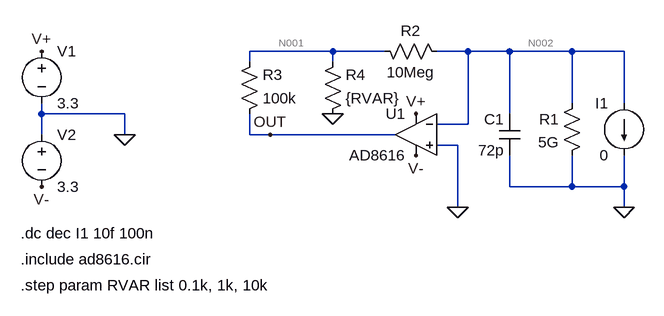
[diagram p0: schematic 002transimpedance_ad8616_three_res.asc]
002transimpedance_ad8616_three_res.asc, the LTspice schematic file:
Version 4
SHEET 1 1156 680
WIRE 112 48 -16 48
WIRE 192 48 112 48
WIRE 320 48 272 48
WIRE 384 48 320 48
WIRE 480 48 384 48
WIRE 560 48 480 48
WIRE -16 64 -16 48
WIRE 112 64 112 48
WIRE 480 128 480 48
WIRE 560 128 560 48
WIRE -336 144 -336 128
WIRE -208 144 -336 144
WIRE 384 144 384 48
WIRE 320 160 320 48
WIRE 320 160 272 160
WIRE -336 176 -336 144
WIRE -208 176 -208 144
WIRE -16 176 -16 144
WIRE 16 176 -16 176
WIRE 208 176 16 176
WIRE 304 192 272 192
WIRE 384 256 384 208
WIRE 480 256 480 208
WIRE 480 256 384 256
WIRE 560 256 560 208
WIRE 560 256 480 256
WIRE 304 288 304 192
WIRE 560 288 560 256
FLAG 560 288 0
FLAG 304 288 0
FLAG -208 176 0
FLAG -336 48 V+
FLAG -336 256 V-
FLAG 240 208 V-
FLAG 240 144 V+
FLAG 16 176 OUT
FLAG 112 144 0
SYMBOL current 560 128 M0
WINDOW 123 0 0 Left 2
WINDOW 39 0 0 Left 2
SYMATTR InstName I1
SYMATTR Value 0
SYMBOL res 496 112 M0
SYMATTR InstName R1
SYMATTR Value 5G
SYMBOL cap 400 144 M0
SYMATTR InstName C1
SYMATTR Value 72p
SYMBOL res 176 32 M90
WINDOW 0 0 56 VBottom 2
WINDOW 3 32 56 VTop 2
SYMATTR InstName R2
SYMATTR Value 10Meg
SYMBOL voltage -336 32 R0
WINDOW 123 0 0 Left 2
WINDOW 39 0 0 Left 2
SYMATTR InstName V1
SYMATTR Value 3.3
SYMBOL voltage -336 160 R0
WINDOW 123 0 0 Left 2
WINDOW 39 0 0 Left 2
SYMATTR InstName V2
SYMATTR Value 3.3
SYMBOL res -32 160 M180
WINDOW 0 36 76 Left 2
WINDOW 3 36 40 Left 2
SYMATTR InstName R3
SYMATTR Value 100k
SYMBOL res 96 160 M180
WINDOW 0 36 76 Left 2
WINDOW 3 36 40 Left 2
SYMATTR InstName R4
SYMATTR Value {RVAR}
SYMBOL Opamps\\opamp2 240 112 M0
SYMATTR InstName U1
SYMATTR Value AD8616
TEXT -368 328 Left 2 !.dc dec I1 10f 100n
TEXT -368 368 Left 2 !.include ad8616.cir
TEXT -368 408 Left 2 !.step param RVAR list 0.1k, 1k, 10k

The netlist it stands for:
* 002transimpedance_ad8616_three_res.asc
I1 N002 0 0
R1 N002 0 5G
C1 N002 0 72p
R2 N001 N002 10Meg
V1 V+ 0 3.3
V2 0 V- 3.3
R3 OUT N001 100k
R4 0 N001 {RVAR}
XU1 0 N002 V+ V- OUT AD8616  ; pins In+ In- V+ V- OUT
.dc dec I1 10f 100n
.include ad8616.cir
.step param RVAR list 0.1k, 1k, 10k
.backanno
.end

* Results of the author's LTspice run, read from the files saved beside the schematic
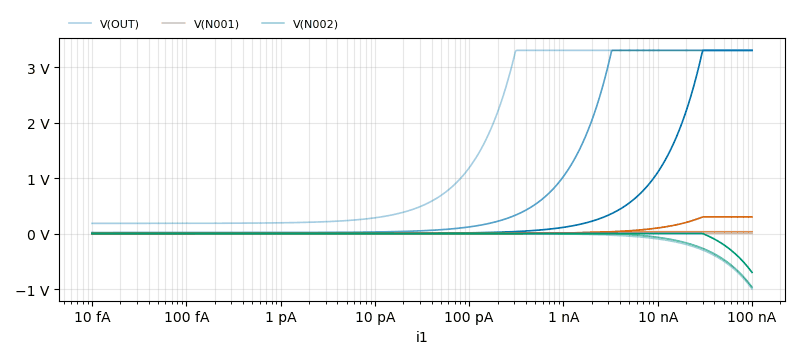
[diagram p1: DC transfer characteristic of 002transimpedance_ad8616_three_res.asc, plotted from the saved traces]
* DC transfer characteristic, 3 runs:
*   V(OUT) [rvar=100]: 183.7 mV at i1=10 fA, 3.3 V at i1=100 nA, min 183.7 mV, max 3.3 V
*   V(OUT) [rvar=1000]: 18.54 mV at i1=10 fA, 3.3 V at i1=100 nA, min 18.54 mV, max 3.3 V
*   V(OUT) [rvar=10000]: 2.019 mV at i1=10 fA, 3.3 V at i1=100 nA, min 2.019 mV, max 3.3 V
*   V(N001) [rvar=100]: 183.5 µV at i1=10 fA, 3.287 mV at i1=100 nA, min 183.5 µV, max 3.296 mV
*   V(N001) [rvar=1000]: 183.5 µV at i1=10 fA, 32.57 mV at i1=100 nA, min 183.5 µV, max 32.67 mV
*   V(N001) [rvar=10000]: 183.5 µV at i1=10 fA, 299.1 mV at i1=100 nA, min 183.5 µV, max 299.7 mV
*   V(N002) [rvar=100]: 183.6 µV at i1=10 fA, -994.7 mV at i1=100 nA, min -994.7 mV, max 183.6 µV
*   V(N002) [rvar=1000]: 183.6 µV at i1=10 fA, -965.5 mV at i1=100 nA, min -965.5 mV, max 183.6 µV
*   V(N002) [rvar=10000]: 183.6 µV at i1=10 fA, -699.5 mV at i1=100 nA, min -699.5 mV, max 183.6 µV